# EAGLE design slave-basic (EAGLE 9.0.0)
DELETE: MF
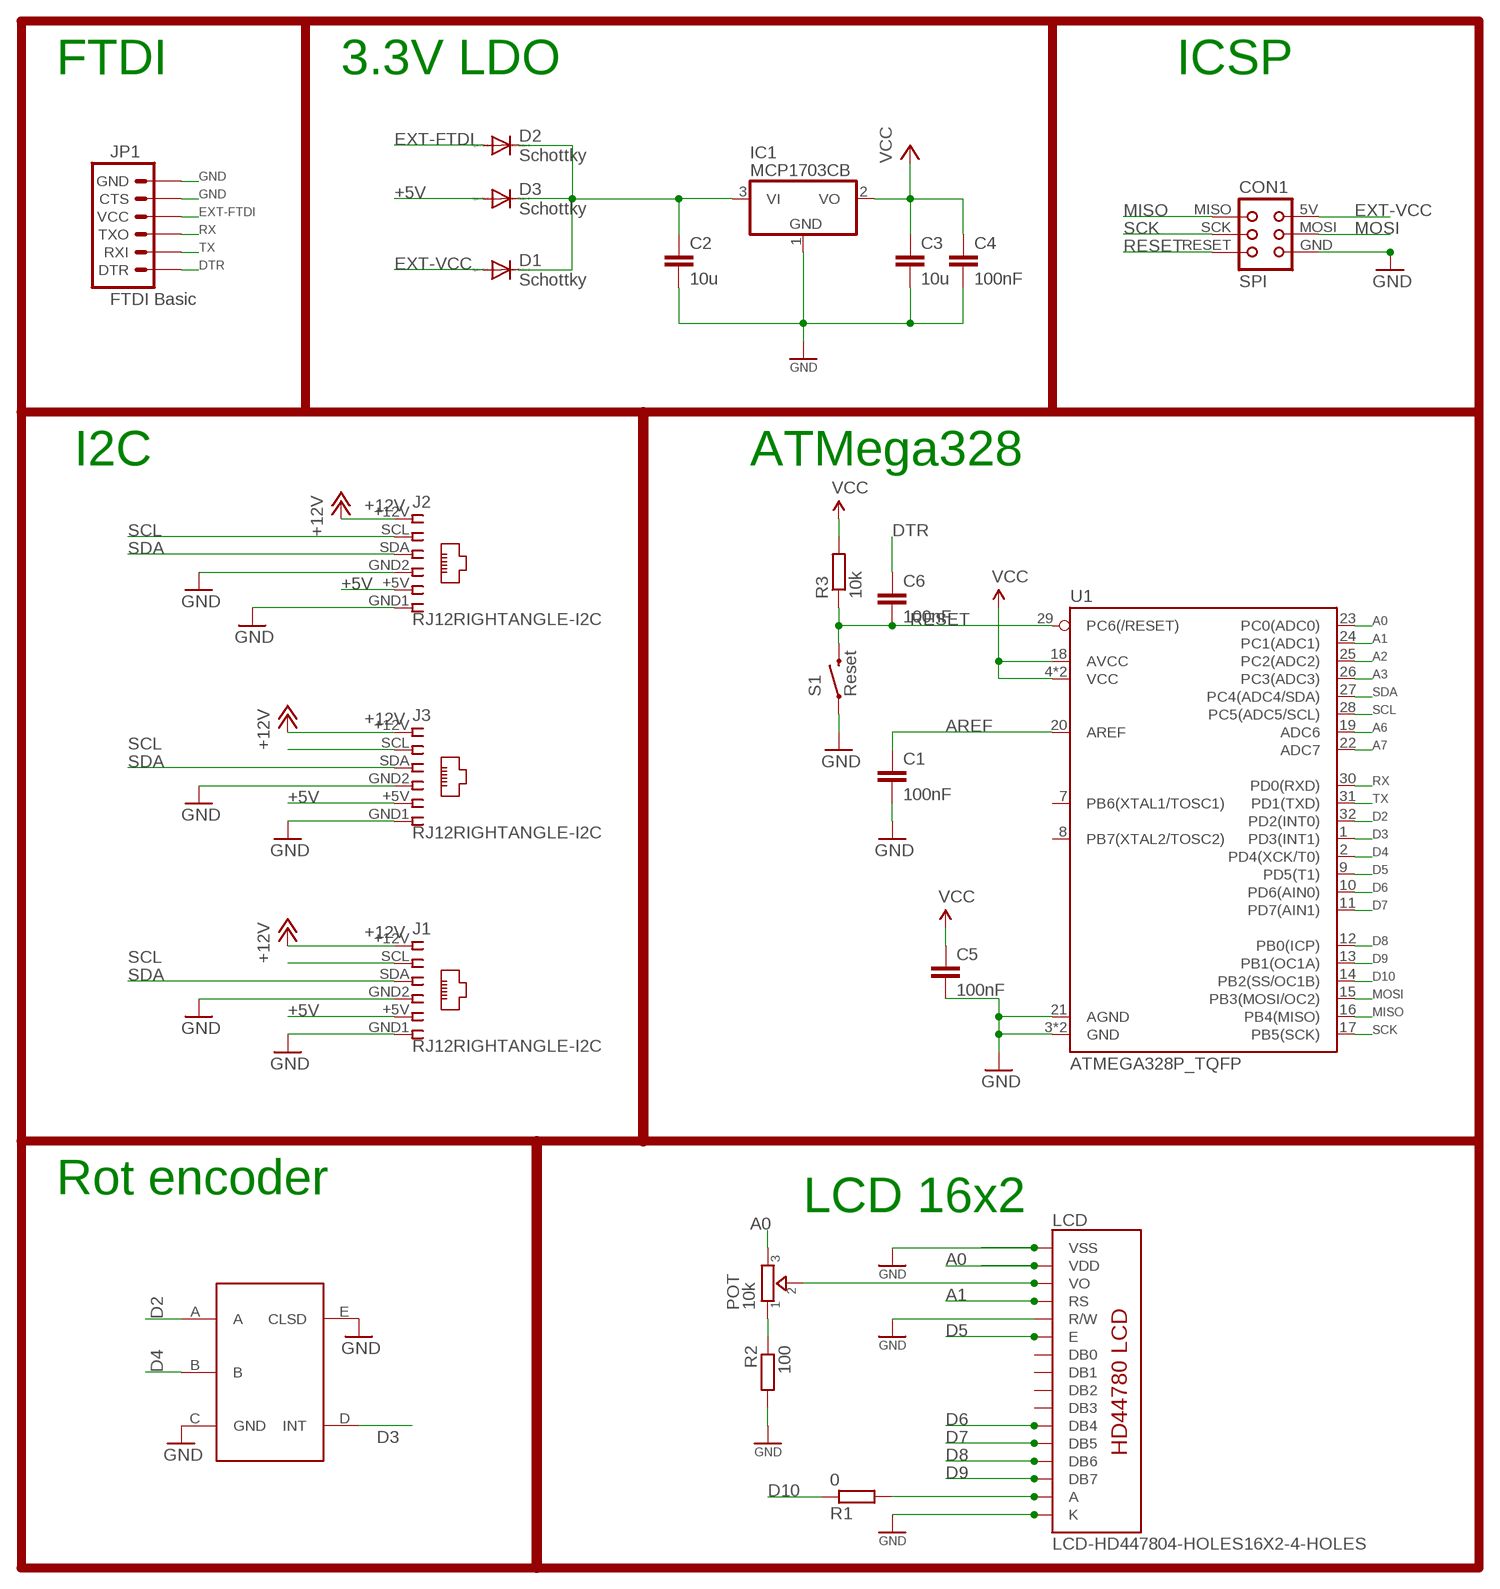
[diagram p0: schematic, sheet 1]

## Parts
C1  100nF  C-EUC0805K  [C0805K]
C2  10u  C-EUC0805K  [C0805K]
C3  10u  C-EUC0805K  [C0805K]
C4  100nF  C-EUC0805K  [C0805K]
C5  100nF  C-EUC0805K  [C0805K]
C6  100nF  C-EUC0805K  [C0805K]
CON1  SPI  TINYISPTAG  [TC2030-MCP]
D1  Schottky  MBR0520LT  [SOD123]
D2  Schottky  MBR0520LT  [SOD123]
D3  Schottky  MBR0520LT  [SOD123]
IC1  MCP1703CB  [SOT23]
J1  RJ12RIGHTANGLE-I2C  [RJ12-RIGHTANGLE-I2C]
J2  RJ12RIGHTANGLE-I2C  [RJ12-RIGHTANGLE-I2C]
J3  RJ12RIGHTANGLE-I2C  [RJ12-RIGHTANGLE-I2C]
JP1  FTDI Basic  ARDUINO_SERIAL_PROGRAMPTH  [1X06]
LCD  LCD-HD447804-HOLES16X2-4-HOLES  [LCD-16X2-4HOLES]
POT  10k  TRIMMER-3362P  [TRIMMER_3362P]
R1  0  R-EU_R0805  [R0805]
R2  100  R-EU_R0805  [R0805]
R3  10k  R-EU_R0805  [R0805]
S1  Reset  SWITCH-MOMENTARY-2SMD-ALT01  [TACTILE-SWITCH-SMD-ALT01]
U1  ATMEGA328P_TQFP  [TQFP32-08]
U$1  EC11E  [EC11E]

## Nets
+5V: D3.A J1.+5V J2.+5V J3.+5V
+12V [power]: J1.+12V J2.+12V J3.+12V
+XV: C2.1 D1.C D2.C D3.C IC1.3(VI)
A0: LCD.2(VDD) POT.3 U1.23(PC0(ADC0))
A1: LCD.4(RS) U1.24(PC1(ADC1))
A2: U1.25(PC2(ADC2))
A3: U1.26(PC3(ADC3))
A6: U1.19(ADC6)
A7: U1.22(ADC7)
AREF: C1.1 U1.20(AREF)
D2: U1.32(PD2(INT0)) U$1.A
D3: U1.1(PD3(INT1)) U$1.D(INT)
D4: U1.2(PD4(XCK/T0)) U$1.B
D5: LCD.6(E) U1.9(PD5(T1))
D6: LCD.11(DB4) U1.10(PD6(AIN0))
D7: LCD.12(DB5) U1.11(PD7(AIN1))
D8: LCD.13(DB6) U1.12(PB0(ICP))
D9: LCD.14(DB7) U1.13(PB1(OC1A))
D10: R1.1 U1.14(PB2(SS/OC1B))
DTR: C6.1 JP1.1(DTR)
EXT-FTDI: D2.A JP1.4(VCC)
EXT-VCC: CON1.5V(VCC) D1.A
GND [power]: C1.2 C2.2 C3.2 C4.2 C5.2 CON1.GND IC1.1(GND) J1.GND1 J1.GND2 J2.GND1 J2.GND2 J3.GND1 J3.GND2 JP1.5(CTS) JP1.6(GND) LCD.1(VSS) LCD.5(R/W) LCD.16(K) R2.2 S1.1 S1.2 U1.3(GND) U1.5(GND) U1.21(AGND) U$1.C(GND) U$1.E(CLSD)
MISO: CON1.MISO U1.16(PB4(MISO))
MOSI: CON1.MOSI U1.15(PB3(MOSI/OC2))
N$2: LCD.3(VO) POT.2
N$4: POT.1 R2.1
N$11: LCD.15(A) R1.2
RESET: C6.2 CON1.RESET R3.1 S1.3 S1.4 U1.29(PC6(/RESET))
RX: JP1.3(TXO) U1.30(PD0(RXD))
SCK: CON1.SCK U1.17(PB5(SCK))
SCL: J1.SCL J2.SCL J3.SCL U1.28(PC5(ADC5/SCL))
SDA: J1.SDA J2.SDA J3.SDA U1.27(PC4(ADC4/SDA))
TX: JP1.2(RXI) U1.31(PD1(TXD))
VCC: C3.1 C4.1 C5.1 IC1.2(VO) R3.2 U1.4(VCC) U1.6(VCC) U1.18(AVCC)
Unconnected: LCD.7(DB0) LCD.8(DB1) LCD.9(DB2) LCD.10(DB3) U1.7(PB6(XTAL1/TOSC1)) U1.8(PB7(XTAL2/TOSC2))

## Notes on the sheet
- FTDI | 3.3V LDO | ICSP
- I2C | ATMega328
- Rot encoder
- LCD 16x2

## Library data of the parts
C1 C4-C6 = rcl:C-EU: CAPACITOR, European symbol; ELECROW: C49678; LCSC: C49678; MPN: 80-C1206C104K5R
C2 C3 = rcl:C-EU: CAPACITOR, European symbol; ELECROW: C15850; LCSC: C15850; MPN: 77-VJ1206V106ZXQTBC
CON1 = lpatiny:TINYISP: CONNECTOR
D1-D3 = diode:MBR0520LT: SCHOTTKY BARRIER RECTIFIER Source: http://onsemi.com .. MBR0520LT1-D.pdf; LCSC: C82544; MPN: 621-1N5819HW-F
IC1 = linear:MCP1703: 250 mA, 16V, Low Quiescent Current LDO Regulator Source: http://ww1.microchip.com/downloads/en/DeviceDoc/22049b.pdf; LCSC: C53352
J1-J3 = lpatiny:RJ12: CORCOM Modular RJ Jacks No Shield Source: www.tycoelectronics.com .. ENG_DS_1654001_1099_RJ_L_0507.pdf
JP1 = SparkFun:ARDUINO_SERIAL_PROGRAM
LCD = HD44780LCD:LCD-HD44780
POT = dp_devices:TRIMMER: Trimmer resistor
R1 = rcl:R-EU_: RESISTOR, European symbol; ELECROW: C17477; LCSC: C17477
R2 = rcl:R-EU_: RESISTOR, European symbol; ELECROW: C17408; LCSC: C17408
R3 = rcl:R-EU_: RESISTOR, European symbol; ELECROW: C17513; LCSC: C17513
S1 = Testing:SWITCH-MOMENTARY-2: Various NO switches- pushbuttons, reed, etc
U1 = SparkFun-IC-Microcontroller:ATMEGA328P_TQFP: Popular 328P in QFP Storefront component: ATmega328 - TQFP <https://www.sparkfun.com/products/13448> (COM-13448) Datasheet <http://www.sparkfun.com/datasheets/Components/SMD/ATMega328.pdf> SparkFun Products SparkFun RedBoard - Programmed with Arduino <https://www.sparkfun.com/products/12757> (DEV-12757) Arduino Pro Mini 328 - 5V/16MHz <https://www.sparkfun.com/products/11113> (DEV-11113) Arduino Pro Mini 328 - 3.3V/8MHz <https://www.sparkfun.com/products/11114> (DEV-11114) SparkFun OpenLog <https://www.sparkfun.com/products/13712> (DEV-13712) SparkFun MicroView - OLED Arduino Module <https://www.sparkfun.com/products/12923> (DEV-12923) SparkFun Digital Sandbox <https://www.sparkfun.com/products/12651> (DEV-12651) SparkFun PicoBoard <https://www.sparkfun.com/products/11888> (WIG-11888) Arduino Fio <https://www.sparkfun.com/products/10116> (DEV-10116) LilyPad Arduino 328 Main Board <https://www.sparkfun.com/products/13342> (DEV-13342) SparkFun RedStick <https://www.sparkfun.com/products/13741> (DEV-13741) LilyPad MP3 <https://www.sparkfun.com/products/11013> (DEV-11013) LilyPad Arduino SimpleSnap <https://www.sparkfun.com/products/10941> (DEV-10941) SparkFun Stepoko <https://www.sparkfun.com/products/13899> (ROB-13899) SparkFun Geiger Counter <https://www.sparkfun.com/products/11345> (SEN-11345) SparkFun EL Sequencer <https://www.sparkfun.com/products/12781> (COM-12781) Arduino Pro 328 - 5V/16MHz <https://www.sparkfun.com/products/10915> (DEV-10915) CryptoCape <https://www.sparkfun.com/products/12773> (DEV-12773) SparkFun IR Thermometer Evaluation Board - MLX90614 <https://www.sparkfun.com/products/10740> (SEN-10740) SparkFun RedBot Mainboard <https://www.sparkfun.com/products/12097> (ROB-12097) Arduino Pro 328 - 3.3V/8MHz <https://www.sparkfun.com/products/10914> (DEV-10914) SparkFun Block for Intel® Edison - Arduino <https://www.sparkfun.com/products/13036> (DEV-13036) SparkFun Simon Says - Surface Mount Soldering Kit <https://www.sparkfun.com/products/10935> (KIT-10935) SparkFun 7-Segment Serial Display - Red <https://www.sparkfun.com/products/11441> (COM-11441) SparkFun 7-Segment Serial Display - White <https://www.sparkfun.com/products/11629> (COM-11629) SparkFun 7-Segment Serial Display - Yellow <https://www.sparkfun.com/products/11443> (COM-11443) SparkFun 7-Segment Serial Display - Kelly Green <https://www.sparkfun.com/products/11440> (COM-11440) SparkFun 7-Segment Serial Display - Blue <https://www.sparkfun.com/products/11442> (COM-11442) SparkFun OpenSegment Serial Display - 20mm (Blue) <https://www.sparkfun.com/products/11647> (COM-11647) SparkFun OpenSegment Serial Display - 20mm (Green) <https://www.sparkfun.com/products/11646> (COM-11646) SparkFun OpenSegment Serial Display - 20mm (White) <https://www.sparkfun.com/products/11648> (COM-11648) SparkFun OpenSegment Serial Display - 20mm (Red) <https://www.sparkfun.com/products/11644> (COM-11644) SparkFun OpenSegment Serial Display - 20mm (Yellow) <https://www.sparkfun.com/products/11645> (COM-11645) SparkFun OpenSegment Shield <https://www.sparkfun.com/products/13190> (DEV-13190); PROD_ID: IC-09069
U$1 = lpatiny:EC11E: ALPS Rotary encoder

## Net classes
0 default: width 0.254 mm, clearance 0.25 mm
1 power: width 0.254 mm, drill 0.305 mm, clearance 0.25 mm
2 VIN: width 0.406 mm, clearance 0.25 mm
3 fine: width 0.406 mm, clearance 0.25 mm
4 aref: width 0.406 mm, clearance 0.25 mm

## Board
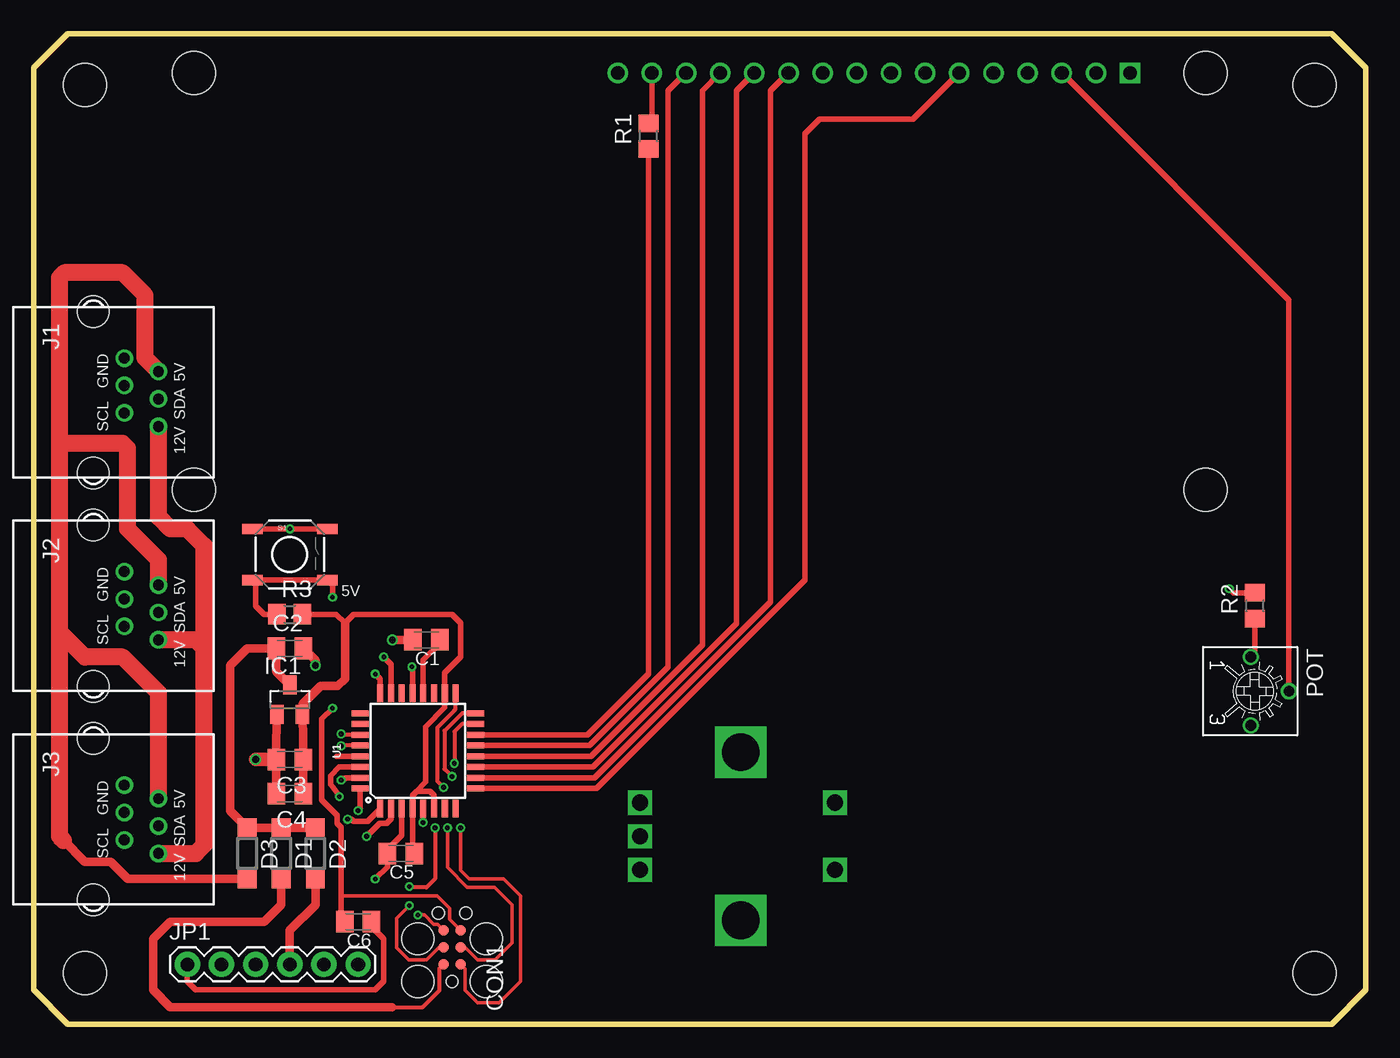
[diagram p1: board, top side]
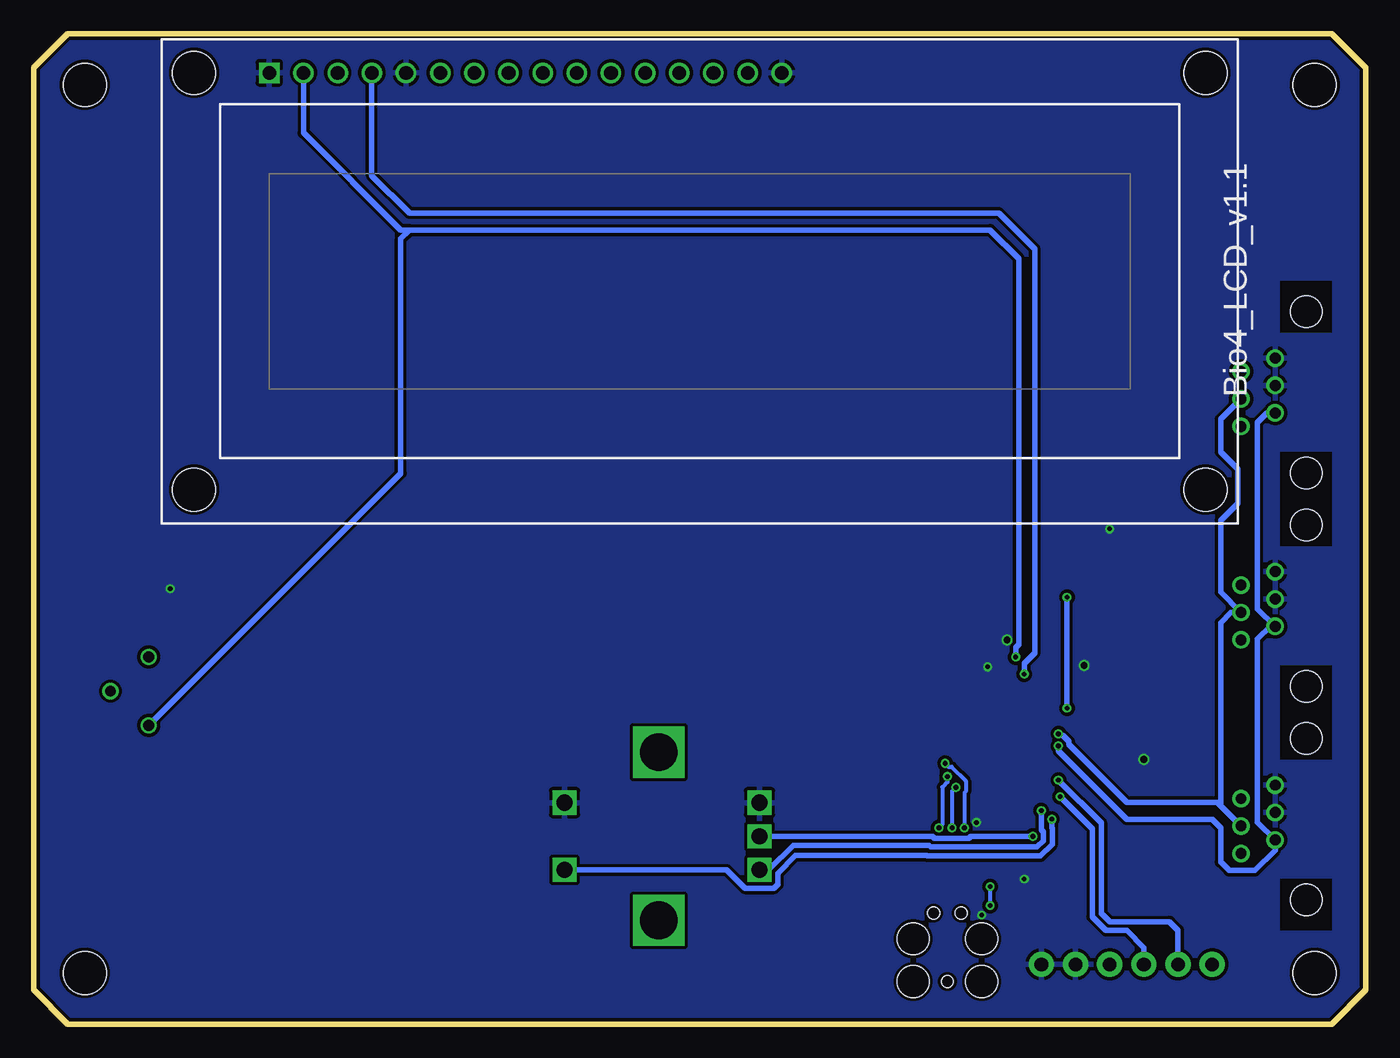
[diagram p2: board, bottom side, seen from below]

Size 99.06 x 73.66 mm. Coordinates in mm from the lower left corner, seen from the top.
Outline: 0,71.12 0,2.54 2.54,0 96.52,0 99.06,2.54 99.06,71.12 96.52,73.66 2.54,73.66 0,71.12
Copper layers (1*16): Top 0.035mm / dielectric 0.2mm / Bottom 0.035mm
Design rules "SeeedStudio_DRU_no_angle_20130527 *": minimum track width 8mil, minimum drill 12mil, track to track 6mil, track to pad 6mil, pad to pad 6mil, via to via 6mil, smd to smd 0mil, copper to edge 10mil, drill to drill 10mil, minimum pad ring 6mil, minimum via ring 6mil, stop-mask expansion 2mil, vias tented up to drill 25mil, thermal gap 10mil
Holes 3.2 mm at 3.81,69.85 3.81,3.81 95.25,69.85 95.25,3.81

### Footprints (pad centres in the part's own frame; a part is rotated, then mirrored left to right if it is on the bottom)
C0805K = smd 1.3 x 1.6: 1 -1,0; 2 1,0
TC2030-MCP = smd 0.787 x 0.787: 5V 1.27,0.635; GND 3.81,0.635; MISO 1.27,-0.635; MOSI 2.54,0.635; RESET 3.81,-0.635; SCK 2.54,-0.635 | hole 0.889: 0,0; 5.08,-1.016; 5.08,1.016 | hole 2.375: 0,2.54; 0,-2.54; 3.175,-2.54; 3.175,2.54
SOD123 = smd 1.4 x 1.4: A 1.9,0; C -1.9,0
SOT23 = smd 1 x 1.4: 1 -0.95,-1.1; 2 0.95,-1.1; 3 0,1.1
RJ12-RIGHTANGLE-I2C = drill 0.8 pad 1.3: +5V -1.54,4.84; +12V 2.54,4.84; GND1 -2.54,2.3; GND2 -0.5,2.3; SCL 1.54,2.3; SDA 0.5,4.84 | hole 2.36: -6,0; 6,0
1X06 = drill 1.016 pad 1.88: 1 0,0; 2 2.54,0; 3 5.08,0; 4 7.62,0; 5 10.16,0; 6 12.7,0
LCD-16X2-4HOLES = drill 1.016 square: 1 -32,15.5 | drill 1.016: 2 -29.46,15.5; 3 -26.92,15.5; 4 -24.38,15.5; 5 -21.84,15.5; 6 -19.3,15.5; 7 -16.76,15.5; 8 -14.22,15.5; 9 -11.68,15.5; 10 -9.14,15.5; 11 -6.6,15.5; 12 -4.06,15.5; 13 -1.52,15.5; 14 1.02,15.5; 15 3.56,15.5; 16 6.1,15.5 | hole 3.2: -37.6,15.5; -37.6,-15.5; 37.6,-15.5; 37.6,15.5
TRIMMER_3362P = drill 0.8: 1 -2.54,-0.31; 2 0,2.54; 3 2.54,-0.31
R0805 = smd 1.3 x 1.5: 1 -0.95,0; 2 0.95,0
TACTILE-SWITCH-SMD-ALT01 = smd 1.524 x 0.762: 1 -2.794,1.905; 2 2.794,1.905; 3 -2.794,-1.905; 4 2.794,-1.905
TQFP32-08 = smd 1.27 x 0.45: 1 -4.293,2.8; 2 -4.293,2; 3 -4.293,1.2; 4 -4.293,0.4; 5 -4.293,-0.4; 6 -4.293,-1.2; 7 -4.293,-2; 8 -4.293,-2.8; 17 4.293,-2.8; 18 4.293,-2; 19 4.293,-1.2; 20 4.293,-0.4; 21 4.293,0.4; 22 4.293,1.2; 23 4.293,2; 24 4.293,2.8 | smd 0.45 x 1.27: 9 -2.8,-4.293; 10 -2,-4.293; 11 -1.2,-4.293; 12 -0.4,-4.293; 13 0.4,-4.293; 14 1.2,-4.293; 15 2,-4.293; 16 2.8,-4.293; 25 2.8,4.293; 26 2,4.293; 27 1.2,4.293; 28 0.4,4.293; 29 -0.4,4.293; 30 -1.2,4.293; 31 -2,4.293; 32 -2.8,4.293
EC11E = drill 1.2 square: A -2.5,0; B 0,0; C 2.5,0; D -2.5,14.5; E 2.5,14.5 | drill 2.8 square: P$1 6.25,7.5; P$2 -6.25,7.5

### Placement (x,y rotation side)
C1  29.21,28.57 180 top
C2  19.05,27.94 0 top
C3  19.05,19.68 180 top
C4  19.05,17.14 180 top
C5  27.3,12.7 180 top
C6  24.13,7.62 180 top
CON1  31.11,3.17 90 top
D1  18.41,12.7 270 top
D2  20.95,12.7 270 top
D3  15.88,12.7 270 top
IC1  19.05,24.13 0 top
J1  4.45,46.99 270 top
J2  4.45,31.11 270 top
J3  4.45,15.24 270 top
JP1  11.43,4.45 0 top
LCD  49.53,55.24 0 bottom
POT  90.81,24.77 270 top
R1  45.72,66.04 90 top
R2  90.81,31.11 90 top
R3  19.05,30.48 0 top
S1  19.05,34.92 0 top
U1  28.57,20.32 90 top
U$1  45.09,13.97 90 bottom

### Tracks (layer width: path | path; a pad name or v marks a point on that pad's centre or on a via)
+5V
  Top 0.635: D3.A 6.98,10.8 5.71,12.06 3.81,12.06 2.22,13.65 1.91,13.97
  Top 1.27: J3.+5V 9.29,24.63 6.61,27.3 3.81,27.3 1.91,29.21 | 1.91,43.18 1.91,29.21 | 1.91,55.24 1.91,43.18 | J2.+5V 9.29,34.53 6.99,36.83 6.99,42.81 6.61,43.18 2.28,43.18 2.09,42.99 1.91,43.18 | J1.+5V 8.28,49.53 8.28,54.21 6.61,55.88 2.28,55.88 1.91,55.51 1.91,55.24 | 1.91,55.24 | 1.91,29.21 1.91,13.97 2.22,13.65
+12V
  Top 1.27: J3.+12V 12.06,12.7 12.7,13.34 12.7,27.94 | 12.7,27.94 12.06,28.57 J2.+12V | 12.7,27.94 12.7,35.56 11.43,36.83 10.16,36.83 9.29,37.7 J1.+12V
+XV
  Top 0.635: D2.C D1.C D3.C 14.61,15.87 14.61,26.67 15.88,27.94 C2.1 18.05,26.23 IC1.3
A0  (via drill 0.35)
  Top 0.406: v26.04,27.3 26.57,26.77 U1.23
  Bottom 0.406: v26.04,27.3 26.04,28 25.81,28.22 25.81,56.93 27.94,59.05 71.12,59.05 | 71.12,59.05 71.75,59.05 78.99,66.29 LCD.2 | 71.12,59.05 71.75,58.42 71.75,40.97 POT.3
A1  (via drill 0.35)
  Top 0.406: v25.4,26.04 25.77,25.66 U1.24
  Bottom 0.406: v25.4,26.04 25.4,26.84 24.62,27.62 24.62,57.64 27.3,60.33 71.12,60.33 73.91,63.12 LCD.4
AREF
  Top 0.406: C1.1 30.21,28.3 28.98,27.07 U1.20
D2  (via drill 0.35)
  Top 0.406: U1.32 24.28,16.03 v24.13,15.88
  Bottom 0.406: U$1.A 44.41,11.47 42.57,13.31 32.49,13.31 32.34,13.17 24.46,13.17 23.98,13.65 23.98,14.29 24.13,14.44 v24.13,15.88
D3  (via drill 0.35)
  Top 0.406: v23.35,15.24 23.66,15.24 23.81,15.09 24.84,15.09 U1.1
  Bottom 0.406: U$1.D 47.53,11.47 46.17,10.12 44,10.12 43.73,10.38 43.73,11.22 42.4,12.55 32.66,12.55 32.62,12.51 24.19,12.51 23.33,13.38 23.33,14.56 23.35,14.59 v23.35,15.24
D4  (via drill 0.35)
  Top 0.406: v24.77,13.97 25.73,14.94 26.24,14.94 26.57,15.27 U1.2
  Bottom 0.406: U$1.B 32.22,13.97 32.07,13.82 29.52,13.82 29.38,13.97 v24.77,13.97
D5
  Top 0.406: LCD.6 65.39,67.31 58.42,67.31 57.34,66.23 57.34,33.02 41.85,17.52 U1.9
D6
  Top 0.406: LCD.11 54.8,69.42 54.8,31.41 41.72,18.32 U1.10
D7
  Top 0.406: LCD.12 52.27,69.42 52.27,29.8 41.59,19.12 U1.11
D8
  Top 0.406: 41.53,19.99 41.57,20.03 | 41.57,20.03 49.73,28.18 49.73,69.42 LCD.13 | 41.57,20.03 41.46,19.92 U1.12
D9
  Top 0.406: 41.4,20.79 41.42,20.81 | 41.42,20.81 47.19,26.57 47.19,69.42 LCD.14 | 41.42,20.81 41.33,20.72 U1.13
D10
  Top 0.406: R1.1 45.72,26.04 41.2,21.52 U1.14
DTR
  Top 0.406: JP1.1 11.43,3.17 12.06,2.54 25.4,2.54 26.04,3.17 26.04,6.35 25.13,7.25 C6.1
EXT-FTDI
  Top 0.635: D2.A 20.95,8.89 19.05,6.99 JP1.4
EXT-VCC
  Top 0.305: CON1.5V 30.17,4.13 30.17,2.52 28.92,1.27 26.67,1.27
  Top 0.635: 26.67,1.27 10.16,1.27 8.89,2.54 8.89,6.35 10.16,7.62 17.14,7.62 18.41,8.89 D1.A
GND  (via drill 0.35, 0.5)
  Top 0.254: CON1.GND 30.04,7.43 29.76,7.43 29.07,8.12 v28.57,8.12
  Top 0.406: S1.2 v19.05,36.83 S1.1 | 28.18,28.54 C1.2 | R2.2 89.22,32.06 v88.9,32.38 | U1.3 27.38,14.04 26.67,13.34 26.67,13.06 C5.2 26.3,11.7 v25.4,10.79 | U1.21 28.18,26.35 28.12,26.4 v28.12,26.57 | U1.5 28.98,15.02 v28.96,14.99
  Top 0.635: IC1.1 18.05,21.07 C3.2 C4.2 | C1.2 v26.67,28.57 | C2.2 20.95,27.04 v20.95,26.67
  Top 1.016: C3.2 v16.51,19.68
  pour Bottom: 0,71.12 0,2.54 2.54,0 96.52,0 99.06,2.54 99.06,71.12 96.52,73.66 2.54,73.66
MISO  (via drill 0.35)
  Top 0.254: CON1.MISO 32.09,4.11 32.09,2.52 33.01,1.61 34.63,1.61 36.2,3.17 36.2,9.53 34.92,10.79 32.38,10.79 31.75,11.43 v31.75,14.61
  Top 0.305: v31.11,18.41 30.56,18.97 30.56,21.82 31.86,23.12 U1.16
  Bottom 0.305: v31.11,18.41 31.11,18.01 31.5,17.62 31.5,14.85 v31.75,14.61
MOSI  (via drill 0.35)
  Top 0.254: CON1.MOSI 30.16,5.71 29.23,4.78 27.89,4.78 26.98,5.69 26.98,7.86 v27.94,8.82
  Top 0.305: v31.29,19.39 31.29,21.76 31.84,22.32 U1.15 | v29.84,14.61 29.84,10.79 29.21,10.16 28.01,10.16 v27.94,10.23
  Bottom 0.305: v31.29,19.39 31.04,19.14 30.81,19.14 29.75,18.08 29.75,17.31 29.84,17.21 v29.84,14.61 | v27.94,10.23 v27.94,8.82
N$2
  Top 0.406: POT.2 93.34,53.85 LCD.3
N$4
  Top 0.406: R2.1 90.81,27.61 POT.1
N$11
  Top 0.406: LCD.15 45.97,67.24 R1.2
RESET  (via drill 0.35)
  Top 0.254: CON1.RESET 30.92,7.81 30.92,8.6 30,9.53 22.86,9.53
  Top 0.406: 21.42,17.55 21.43,17.54 | U1.29 24.27,19.91 22.54,19.91 | C6.2 22.86,7.89 22.86,9.53 22.86,14.62 22.57,14.92 22.57,15.53 21.42,16.68 21.42,22.69 v22.23,23.5 | R3.1 17.14,30.48 16.51,31.11 16.51,32.77 S1.3 S1.4 22.23,32.64 v22.23,31.75
  Bottom 0.406: v22.23,23.5 v22.23,31.75
RX  (via drill 0.35)
  Top 0.406: v22.74,16.92 22.28,17.62 22.08,17.82 22.08,18.47 22.73,19.12 U1.30
  Bottom 0.406: v22.74,16.92 20.34,14.52 20.34,7.98 19.32,6.96 17.78,6.96 16.51,5.69 JP1.3
SCK  (via drill 0.35)
  Top 0.254: CON1.SCK 32.07,5.71 33.01,4.78 34.3,4.78 35.56,6.04 35.56,8.89 34.27,10.19 32.25,10.19 30.77,11.66 v30.77,14.61
  Top 0.305: 31.3,23.34 31.28,23.33 | 31.28,23.33 30,22.05 30,18.09 v30.48,17.61 | U1.17 31.38,23.42 31.28,23.33
  Bottom 0.305: v30.48,17.61 30.77,17.32 v30.77,14.61
SCL  (via drill 0.35)
  Top 0.305: U1.28 22.86,20.72 v22.86,20.68
  Top 0.406: v22.86,20.68 22.89,20.72
  Bottom 0.406: v22.86,20.68 22.86,20.32 17.78,15.24 11.43,15.24 10.79,14.61 10.79,12.06 10.16,11.43 8.26,11.43 6.75,12.94 J3.SCL 8.06,15.01 8.06,28.63 7.12,29.57 J2.SCL 8.06,30.89 8.06,44.75 7.36,45.45 J1.SCL
SDA  (via drill 0.35)
  Top 0.305: U1.27 22.93,21.52
  Top 0.406: 22.93,21.52 v22.86,21.59
  Bottom 0.406: 10.79,16.25 10.79,29.84 10.03,30.61 J2.SDA 10.79,32.12 10.79,37.47 9.53,38.73 9.53,41.27 10.79,42.55 10.79,44.98 J1.SDA | 10.79,16.25 J3.SDA | 10.79,16.25 11.05,16.51 17.78,16.51 22.08,20.81 22.08,21.01 22.54,21.47 22.74,21.47 v22.86,21.59
TX  (via drill 0.35)
  Top 0.406: v22.86,18.14 22.98,18.27 23.18,18.27 23.18,18.32 U1.31
  Bottom 0.406: v22.86,18.14 19.68,14.97 19.68,8.26 19.05,7.62 14.61,7.62 13.97,6.99 JP1.2
VCC
  Top 0.406: C5.1 28.18,12.83 U1.4 28.18,17.03 28.46,17.32 | U1.6 29.77,17.03 29.49,17.32 28.46,17.32 | 28.46,17.32 29.15,18 29.15,22.12 30.57,23.55 U1.18 30.57,26.13 31.75,27.3 31.75,29.84 31.11,30.48 23.78,30.48 23.15,29.84 22.51,30.48 R3.2
  Top 0.635: C4.1 C3.1 20.05,21.07 IC1.2 20,23.81 21.33,25.14 22.6,25.14 23.15,25.69 23.15,29.84

### Text on the board
tNames: 5V
bNames: Bio4_LCD_v1.1
tValues: Slave I2C - LCD screen / V 1.0.0
bValues: Slave I2C - LCD screen / V 1.0.0